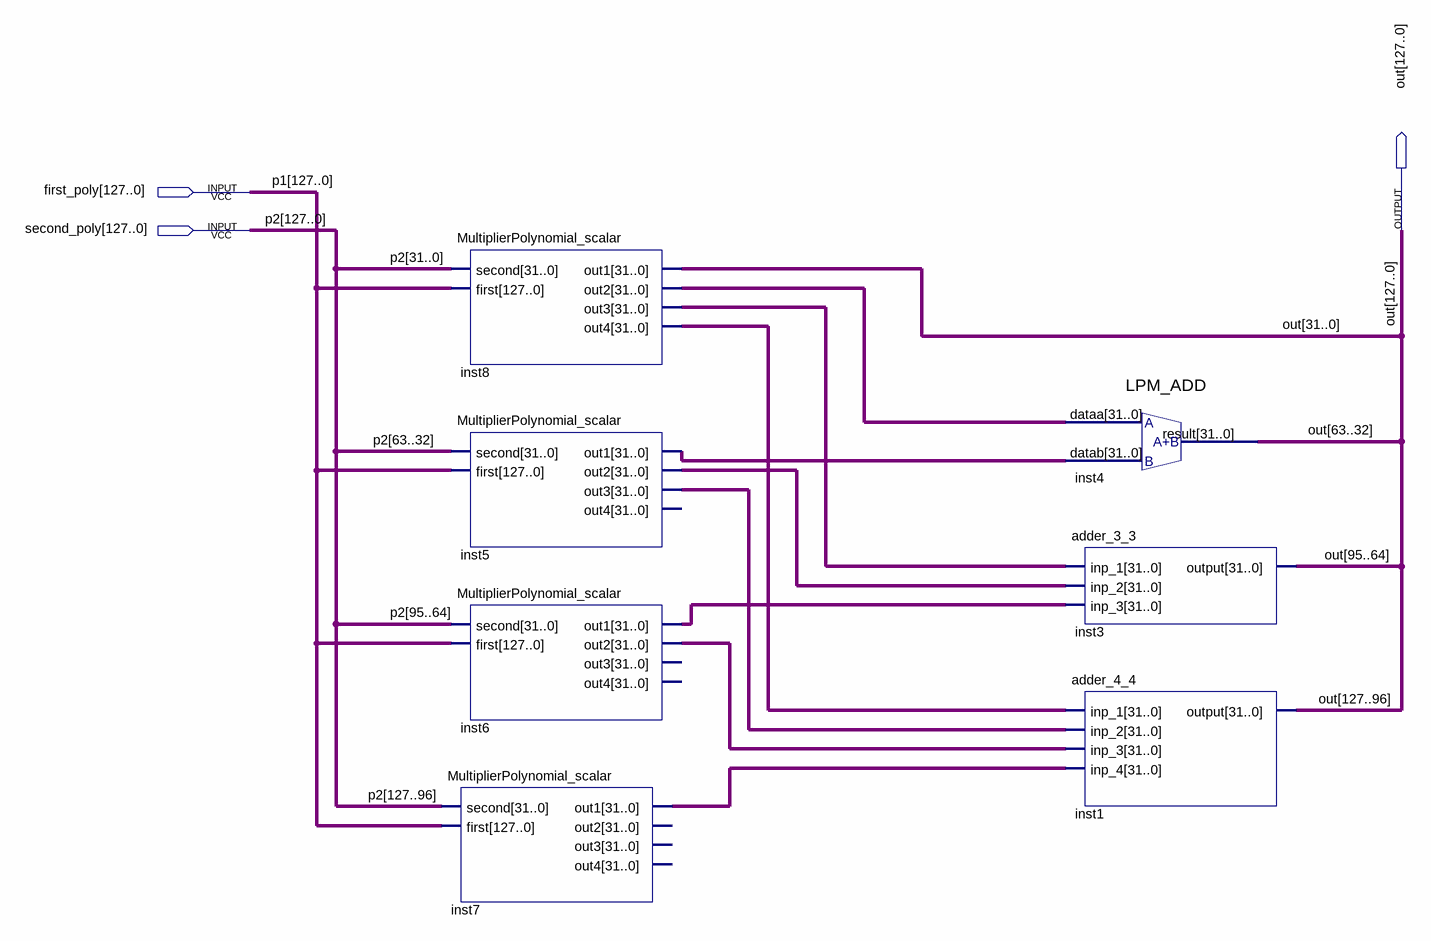
[diagram p0: schematic sheet]
// Quartus schematic MultiplierPolynomial_multi.bdf as structural Verilog: 7 symbols, 3 pins
module MultiplierPolynomial_multi (
  input  [127:0] first_poly,
  input  [127:0] second_poly,
  output [127:0] out
);

  wire [31:0] inst5_out1, inst5_out2, inst5_out3, inst6_out1, inst6_out2, inst7_out1, inst8_out2, inst8_out3,
       inst8_out4;

  MultiplierPolynomial_scalar inst8 (
    .second(second_poly[31:0]), .first(first_poly), .out1(out[31:0]), .out2(inst8_out2), .out3(inst8_out3),
    .out4(inst8_out4));
  MultiplierPolynomial_scalar inst5 (
    .second(second_poly[63:32]), .first(first_poly), .out1(inst5_out1), .out2(inst5_out2), .out3(inst5_out3));  // open: out4
  MultiplierPolynomial_scalar inst6 (
    .second(second_poly[95:64]), .first(first_poly), .out1(inst6_out1), .out2(inst6_out2));  // open: out3, out4
  MultiplierPolynomial_scalar inst7 (
    .second(second_poly[127:96]), .first(first_poly), .out1(inst7_out1));  // open: out2, out3, out4
  LPM_ADD inst4 (.dataa(inst8_out2), .datab(inst5_out1), .result(out[63:32]));
  adder_3_3 inst3 (.inp_1(inst8_out3), .inp_2(inst5_out2), .inp_3(inst6_out1), .\output (out[95:64]));
  adder_4_4 inst1 (
    .inp_1(inst8_out4), .inp_2(inst5_out3), .inp_3(inst6_out2), .inp_4(inst7_out1), .\output (out[127:96]));

  // Other names for the same wires on the sheet: p1[127:0] = first_poly; p2[127:0] = second_poly
endmodule
